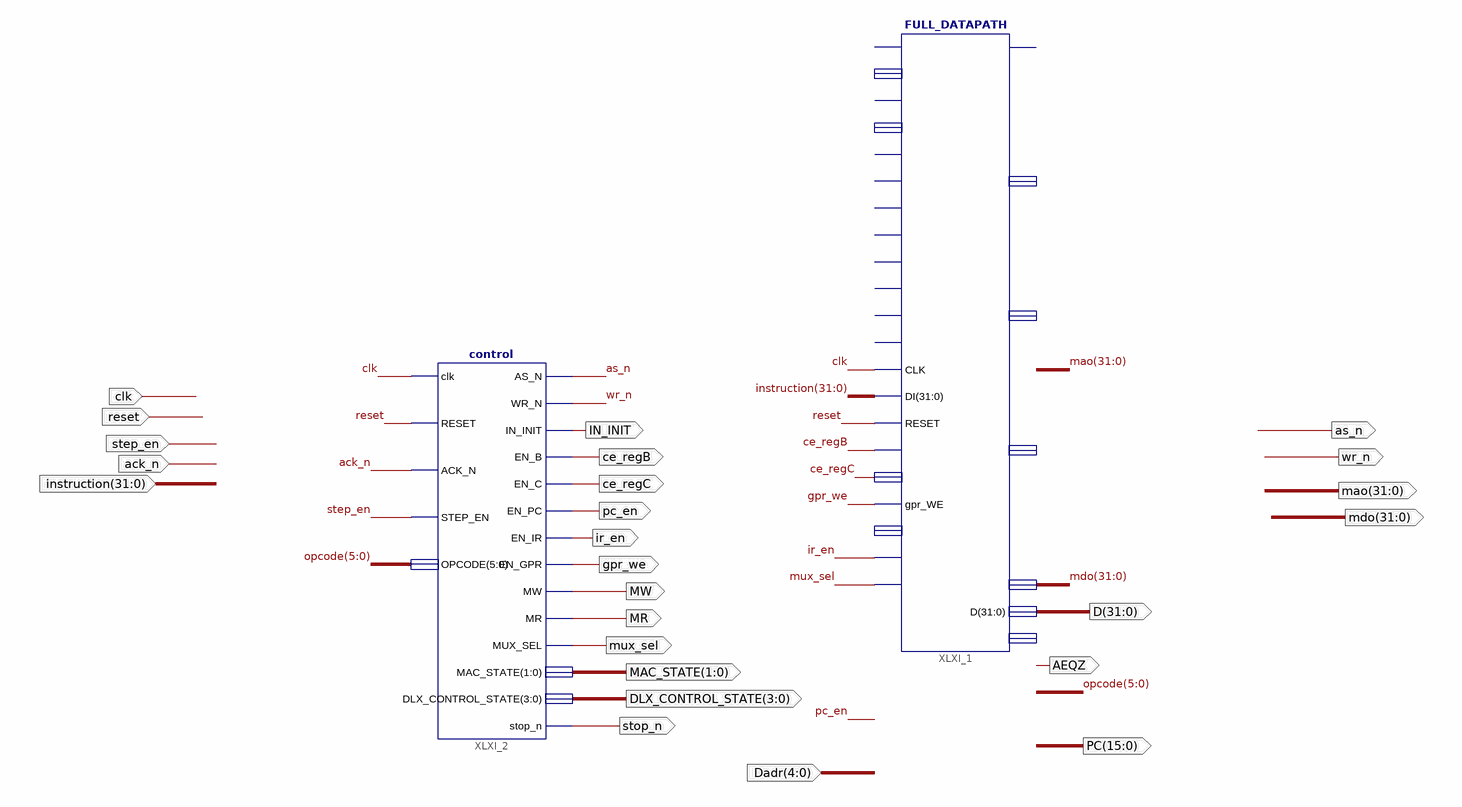
[diagram p0: schematic sheet 1]
// Xilinx ISE schematic LOAD_STORE_machine.sch (spartan6) as structural Verilog: 2 symbols, 25 ports
module LOAD_STORE_machine (
  input  clk,
  input  ack_n,
  input  step_en,
  input  [31:0] instruction,
  input  reset,
  input  [4:0] Dadr,
  output gpr_we,
  output mux_sel,
  output ir_en,
  output pc_en,
  output ce_regC,
  output ce_regB,
  output wr_n,
  output as_n,
  output [31:0] mao,
  output [31:0] mdo,
  output [1:0] MAC_STATE,
  output [3:0] DLX_CONTROL_STATE,
  output IN_INIT,
  output AEQZ,
  output [31:0] D,
  output [15:0] PC,
  output stop_n,
  output MW,
  output MR
);

  wire [5:0] opcode;

  FULL_DATAPATH XLXI_1 (
    .CLK(clk), .DI(instruction), .RESET(reset), .gpr_WE(gpr_we), .Dadr(Dadr), .OPCODE(opcode), .D(D));  // open: MDR_sel, s1sel, PCce, Ace, Bce, Cce, MDRce, IRce, shift, right, test, add, DINTsel, s2sel, MARce, Asel, AEQZ, func, MMU_AO, DO, IR
  control XLXI_2 (
    .clk(clk), .RESET(reset), .ACK_N(ack_n), .STEP_EN(step_en), .OPCODE(opcode), .AS_N(as_n), .MW(MW),
    .WR_N(wr_n), .IN_INIT(IN_INIT), .MR(MR), .EN_B(ce_regB), .EN_C(ce_regC), .EN_PC(pc_en), .EN_IR(ir_en),
    .EN_GPR(gpr_we), .MUX_SEL(mux_sel), .MAC_STATE(MAC_STATE), .DLX_CONTROL_STATE(DLX_CONTROL_STATE),
    .stop_n(stop_n));
endmodule
